# EAGLE schematic TSAL (EAGLE 8.5.1)
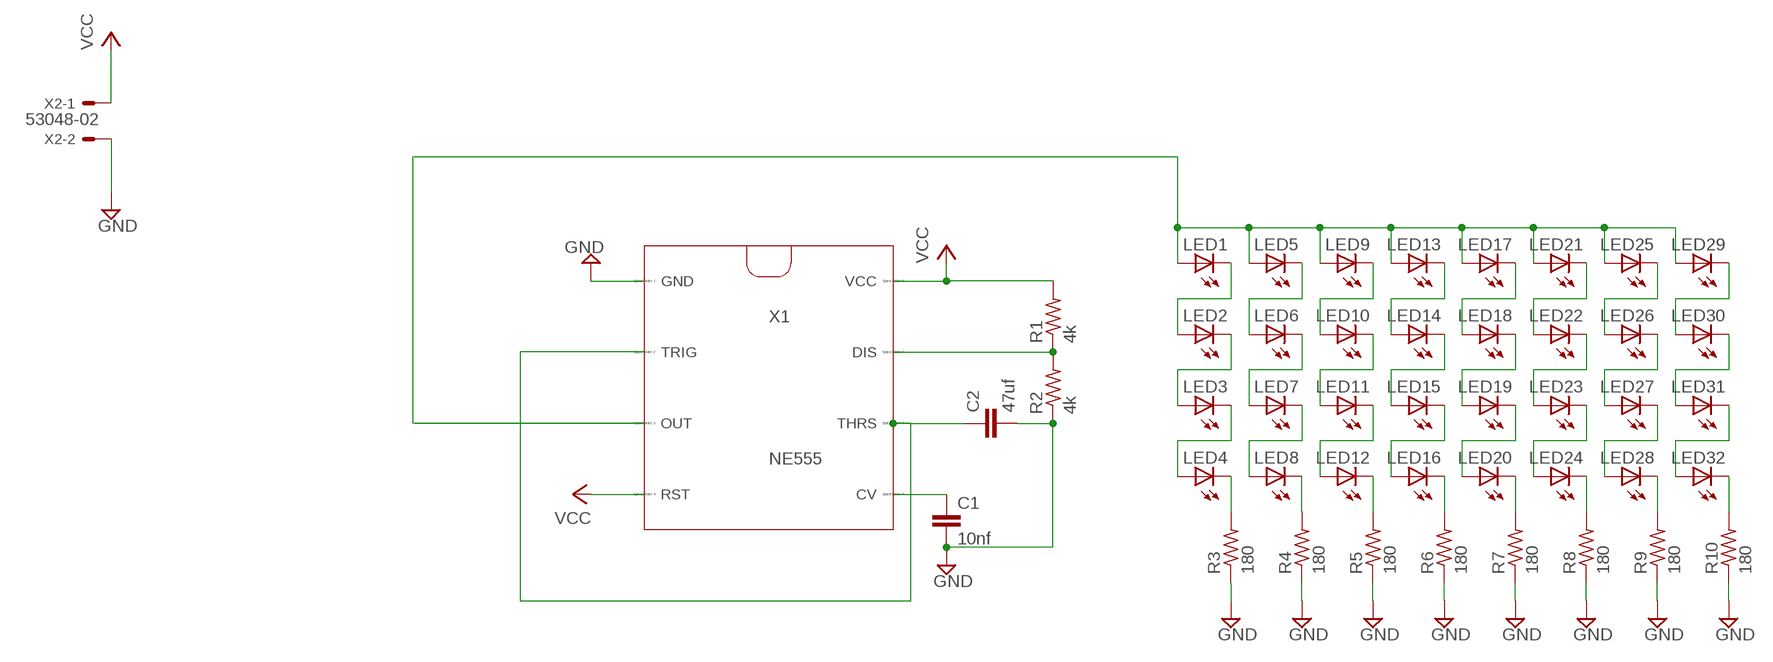
[diagram p0: schematic, sheet 1]

## Parts
C1  10nf  C2,5-3  [C2.5-3]
C2  47uf  C2,5-3  [C2.5-3]
LED1  LED5MM  [LED5MM]
LED2  LED5MM  [LED5MM]
LED3  LED5MM  [LED5MM]
LED4  LED5MM  [LED5MM]
LED5  LED5MM  [LED5MM]
LED6  LED5MM  [LED5MM]
LED7  LED5MM  [LED5MM]
LED8  LED5MM  [LED5MM]
LED9  LED5MM  [LED5MM]
LED10  LED5MM  [LED5MM]
LED11  LED5MM  [LED5MM]
LED12  LED5MM  [LED5MM]
LED13  LED5MM  [LED5MM]
LED14  LED5MM  [LED5MM]
LED15  LED5MM  [LED5MM]
LED16  LED5MM  [LED5MM]
LED17  LED5MM  [LED5MM]
LED18  LED5MM  [LED5MM]
LED19  LED5MM  [LED5MM]
LED20  LED5MM  [LED5MM]
LED21  LED5MM  [LED5MM]
LED22  LED5MM  [LED5MM]
LED23  LED5MM  [LED5MM]
LED24  LED5MM  [LED5MM]
LED25  LED5MM  [LED5MM]
LED26  LED5MM  [LED5MM]
LED27  LED5MM  [LED5MM]
LED28  LED5MM  [LED5MM]
LED29  LED5MM  [LED5MM]
LED30  LED5MM  [LED5MM]
LED31  LED5MM  [LED5MM]
LED32  LED5MM  [LED5MM]
R1  4k  R-US_0207/10  [0207/10]
R2  4k  R-US_0207/10  [0207/10]
R3  180  R-US_0207/10  [0207/10]
R4  180  R-US_0207/10  [0207/10]
R5  180  R-US_0207/10  [0207/10]
R6  180  R-US_0207/10  [0207/10]
R7  180  R-US_0207/10  [0207/10]
R8  180  R-US_0207/10  [0207/10]
R9  180  R-US_0207/10  [0207/10]
R10  180  R-US_0207/10  [0207/10]
X1  NE555  [SOIC8]
X2  53048-02  [53048-02]

## Nets
GND: C1.2 C2.2 R2.1 R3.1 R4.1 R5.1 R6.1 R7.1 R8.1 R9.1 R10.1 X1.1(GND) X2.2
N$1: C2.1 X1.2(TRIG) X1.6(THRS)
N$2: LED1.K(C) LED2.A
N$3: R1.1 R2.2 X1.7(DIS)
N$4: C1.1 X1.5(CV)
N$5: LED13.K(C) LED14.A
N$6: LED2.K(C) LED3.A
N$7: LED3.K(C) LED4.A
N$8: LED5.K(C) LED6.A
N$9: LED6.K(C) LED7.A
N$10: LED7.K(C) LED8.A
N$11: LED4.K(C) R3.2
N$12: LED8.K(C) R4.2
N$13: LED9.K(C) LED10.A
N$14: LED10.K(C) LED11.A
N$15: LED11.K(C) LED12.A
N$16: LED12.K(C) R5.2
N$17: LED14.K(C) LED15.A
N$18: LED15.K(C) LED16.A
N$19: LED16.K(C) R6.2
N$20: LED17.K(C) LED18.A
N$21: LED18.K(C) LED19.A
N$22: LED19.K(C) LED20.A
N$23: LED20.K(C) R7.2
N$24: LED21.K(C) LED22.A
N$25: LED22.K(C) LED23.A
N$26: LED23.K(C) LED24.A
N$27: LED24.K(C) R8.2
N$28: LED25.K(C) LED26.A
N$29: LED26.K(C) LED27.A
N$30: LED27.K(C) LED28.A
N$31: LED28.K(C) R9.2
N$32: LED29.K(C) LED30.A
N$33: LED30.K(C) LED31.A
N$34: LED31.K(C) LED32.A
N$35: LED32.K(C) R10.2
OUT555: LED1.A LED5.A LED9.A LED13.A LED17.A LED21.A LED25.A LED29.A X1.3(OUT)
VCC: R1.2 X1.4(RST) X1.8(VCC) X2.1

## Library data of the parts
C1 = capacitor-wima:C: CAPACITOR naming: grid - package width; OC_NEWARK: unknown
C2 = capacitor-wima:C: CAPACITOR naming: grid - package width; MPN: UVZ1C470MDD1TD; OC_NEWARK: 65R3135
LED1-LED32 = led:LED: LED OSRAM: - CHIPLED LG R971, LG N971, LY N971, LG Q971, LY Q971, LO R971, LY R971 LH N974, LH R974 LS Q976, LO Q976, LY Q976 LO Q996 - Hyper CHIPLED LW Q18S LB Q993, LB Q99A, LB R99A - SideLED LS A670, LO A670, LY A670, LG A670, LP A670 LB A673, LV A673, LT A673, LW A673 LH A674 LY A675 LS A676, LA A676, LO A676, LY A676, LW A676 LS A679, LY A679, LG A679 - Hyper Micro SIDELED® LS Y876, LA Y876, LO Y876, LY Y876 LT Y87S - SmartLED LW L88C, LW L88S LB L89C, LB L89S, LG L890 LS L89K, LO L89K, LY L89K LS L896, LA L896, LO L896, LY L896 - TOPLED LS T670, LO T670, LY T670, LG T670, LP T670 LSG T670, LSP T670, LSY T670, LOP T670, LYG T670 LG T671, LOG T671, LSG T671 LB T673, LV T673, LT T673, LW T673 LH T674 LS T676, LA T676, LO T676, LY T676, LB T676, LH T676, LSB T676, LW T676 LB T67C, LV T67C, LT T67C, LS T67K, LO T67K, LY T67K, LW E67C LS E67B, LA E67B, LO E67B, LY E67B, LB E67C, LV E67C, LT E67C LW T67C LS T679, LY T679, LG T679 LS T770, LO T770, LY T770, LG T770, LP T770 LB T773, LV T773, LT T773, LW T773 LH T774 LS E675, LA E675, LY E675, LS T675 LS T776, LA T776, LO T776, LY T776, LB T776 LHGB T686 LT T68C, LB T68C - Hyper Mini TOPLED® LB M676 - Mini TOPLED Santana® LG M470 LS M47K, LO M47K, LY M47K Source: http://www.osram.convergy.de LUXEON: - LUMILED® LXK2-PW12-R00, LXK2-PW12-S00, LXK2-PW14-U00, LXK2-PW14-V00 LXK2-PM12-R00, LXK2-PM12-S00, LXK2-PM14-U00 LXK2-PE12-Q00, LXK2-PE12-R00, LXK2-PE12-S00, LXK2-PE14-T00, LXK2-PE14-U00 LXK2-PB12-K00, LXK2-PB12-L00, LXK2-PB12-M00, LXK2-PB14-N00, LXK2-PB14-P00, LXK2-PB14-Q00 LXK2-PR12-L00, LXK2-PR12-M00, LXK2-PR14-Q00, LXK2-PR14-R00 LXK2-PD12-Q00, LXK2-PD12-R00, LXK2-PD12-S00 LXK2-PH12-R00, LXK2-PH12-S00 LXK2-PL12-P00, LXK2-PL12-Q00, LXK2-PL12-R00 Source: www.luxeon.com KINGBRIGHT: KA-3528ASYC Source: www.kingbright.com; MPN: C503B-RCN-CW0Z0AA1; OC_NEWARK: 08R2993
R1 R2 = resistor:R-US_: RESISTOR, American symbol; MF: FARNELL; MPN: MCF 0.25W 4K7; OC_NEWARK: 38K0376
R3-R10 = rcl:R-US_: RESISTOR, American symbol; MF: FARNELL; MPN: MCF 0.25W 180R; OC_NEWARK: 38K0345; SPICEPREFIX: R
X1 = Misc:NE555: An idealized 555 timer model.; MF: TEXAS INSTRUMENTS; MPN: NE555P; OC_NEWARK: 60K6706
X2 = con-molex:53?-02: CONNECTOR wire to board 1.25 mm (.049 inch) pitch header; MF: MOLEX; MPN: 53048-0210; OC_FARNELL: 1012259; OC_NEWARK: 57H4718